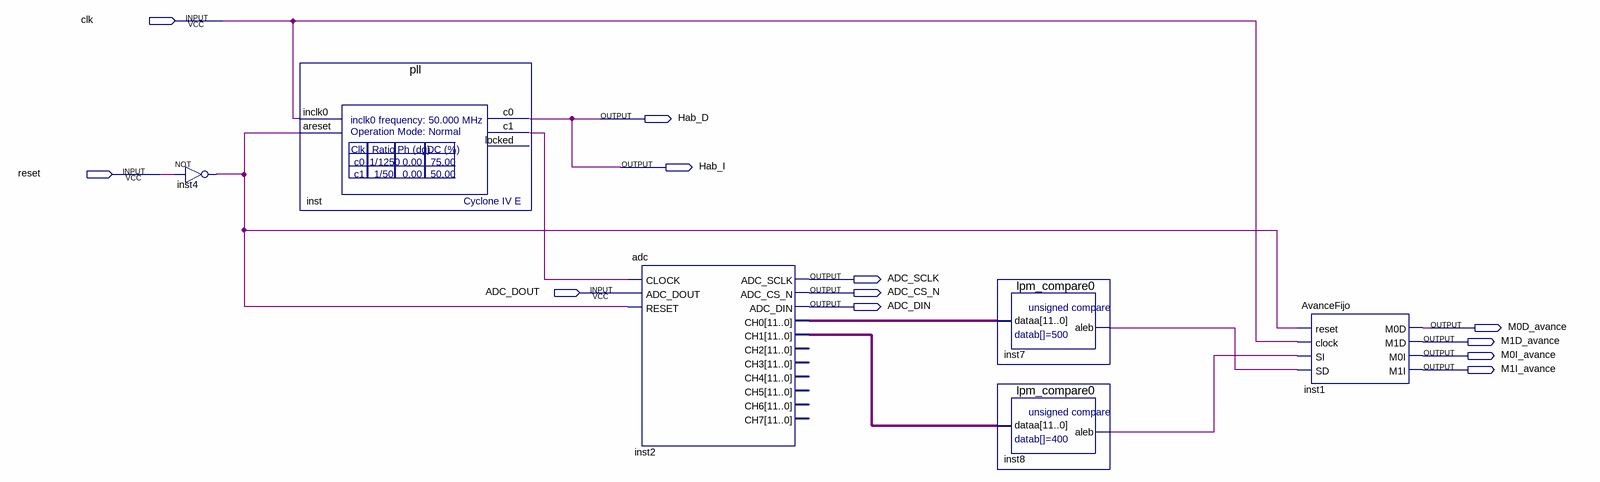
[diagram p0: schematic sheet]
// Quartus schematic Block2.bdf as structural Verilog: 6 symbols, 12 pins
module Block2 (
  input  clk,
  input  reset,
  input  ADC_DOUT,
  output Hab_D,
  output Hab_I,
  output ADC_SCLK,
  output ADC_CS_N,
  output ADC_DIN,
  output M0D_avance,
  output M1D_avance,
  output M0I_avance,
  output M1I_avance
);

  wire inst4_out, inst7_aleb, inst8_aleb, inst_c1;
  wire [11:0] inst2_ch0, inst2_ch1;

  not inst4 (inst4_out, reset);
  pll inst (.inclk0(clk), .areset(inst4_out), .c0(Hab_D), .c1(inst_c1));  // open: locked
  adc inst2 (
    .CLOCK(inst_c1), .ADC_DOUT(ADC_DOUT), .RESET(inst4_out), .ADC_SCLK(ADC_SCLK), .ADC_CS_N(ADC_CS_N),
    .ADC_DIN(ADC_DIN), .CH0(inst2_ch0), .CH1(inst2_ch1));  // open: CH2, CH3, CH4, CH5, CH6, CH7
  lpm_compare0 inst7 (.dataa(inst2_ch0), .aleb(inst7_aleb));
  lpm_compare0 inst8 (.dataa(inst2_ch1), .aleb(inst8_aleb));
  AvanceFijo inst1 (
    .reset(inst4_out), .clock(clk), .SI(inst8_aleb), .SD(inst7_aleb), .M0D(M0D_avance), .M1D(M1D_avance),
    .M0I(M0I_avance), .M1I(M1I_avance));

  assign Hab_I = Hab_D;
endmodule
